# EAGLE schematic vco (EAGLE 8.2.1)
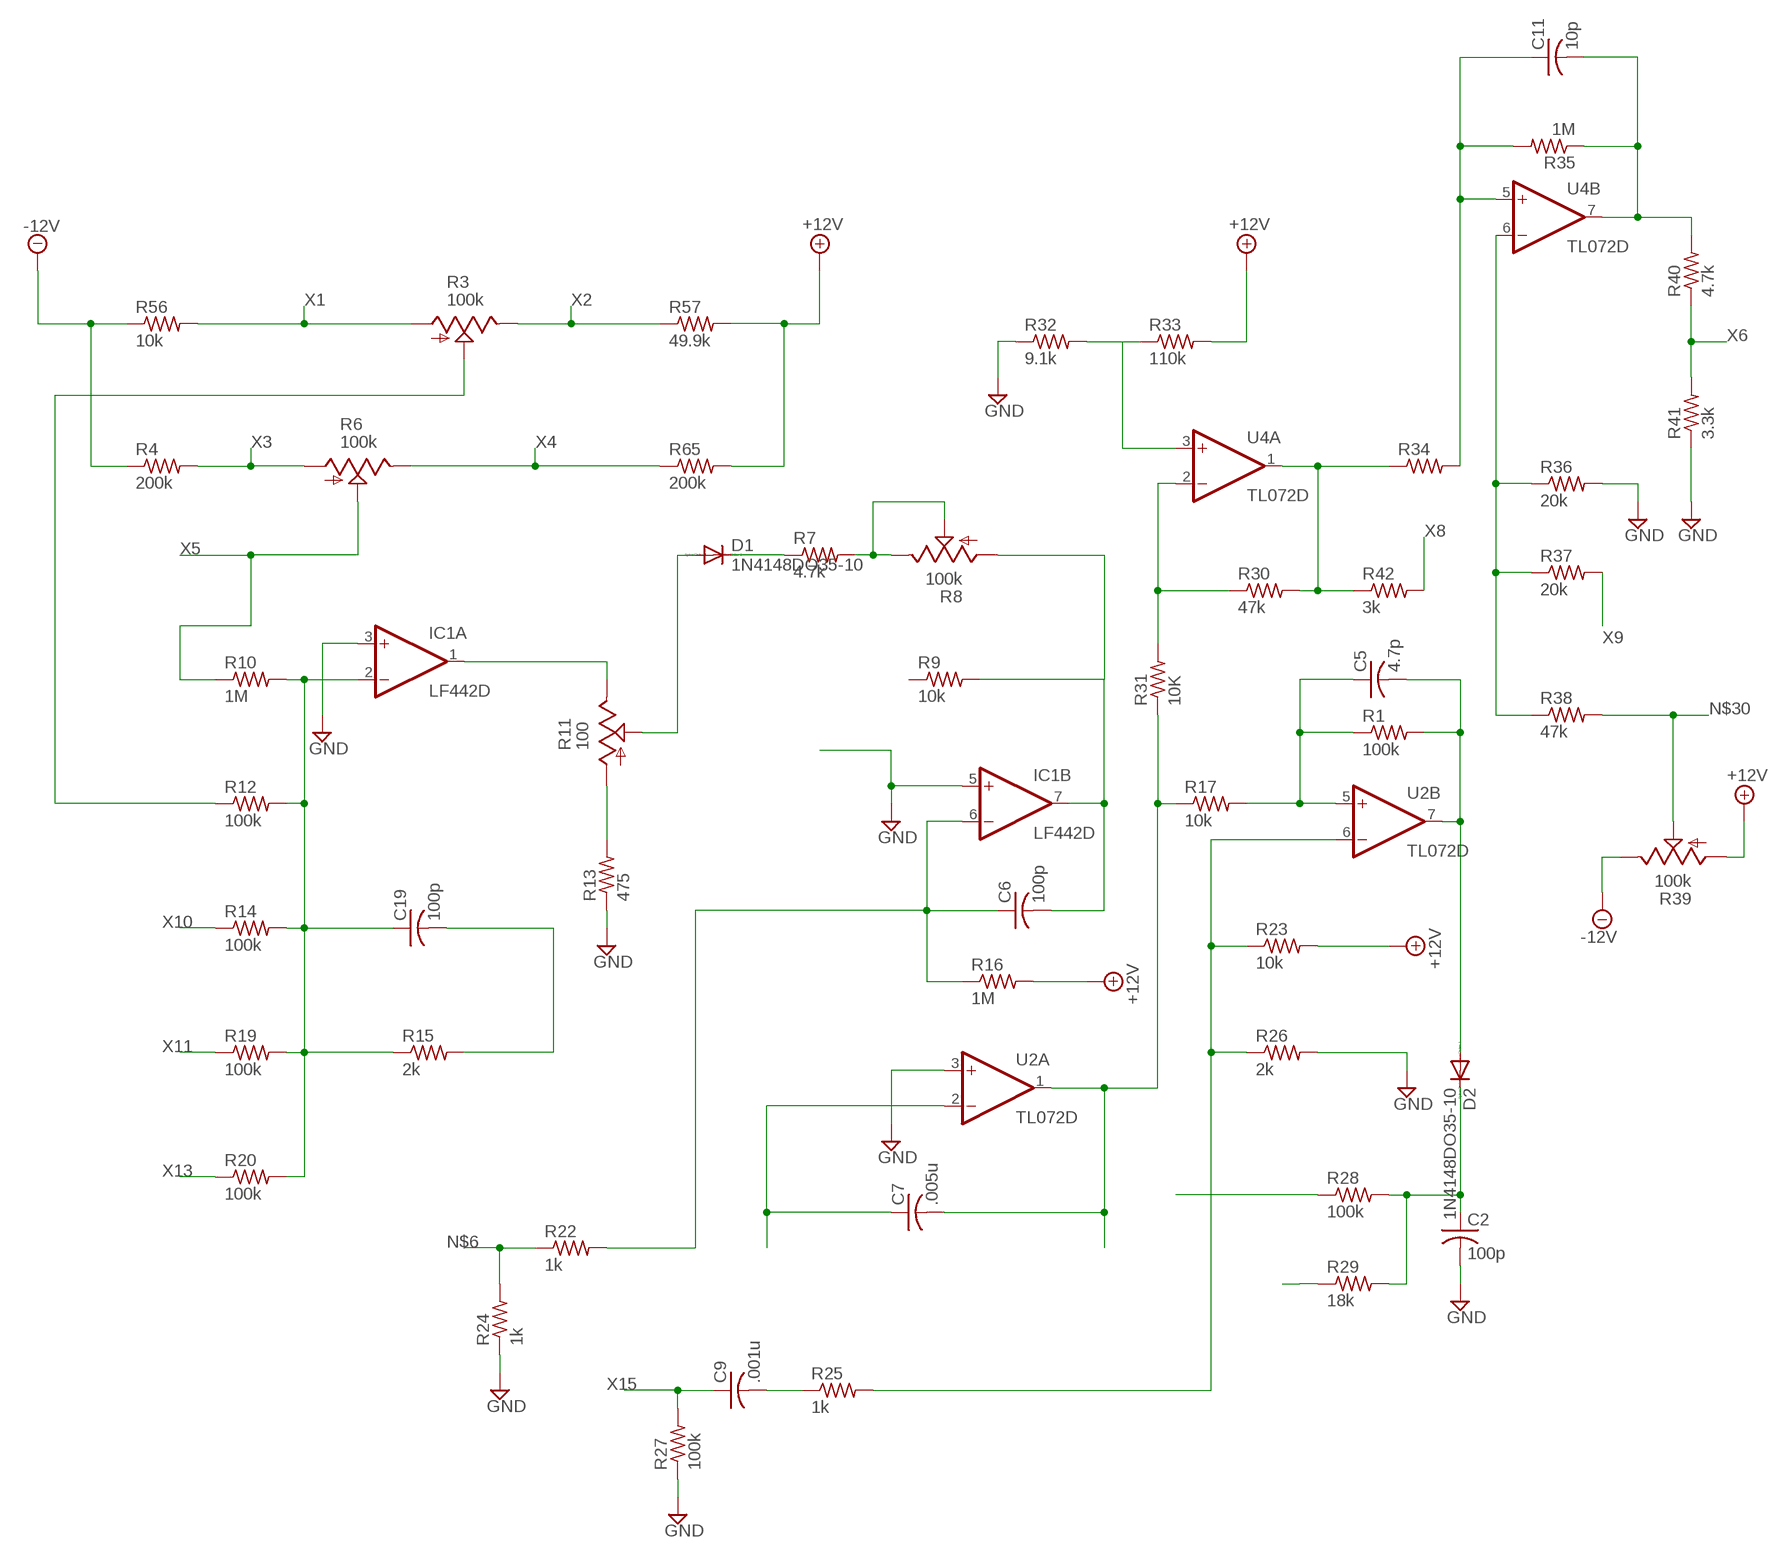
[diagram p0: schematic, sheet 1]

## Parts
C2  100p  C-US050-024X044  [C050-024X044]
C5  4.7p  C-US050-024X044  [C050-024X044]
C6  100p  C-US050-024X044  [C050-024X044]
C7  .005u  C-US050-024X044  [C050-024X044]
C9  .001u  C-US050-024X044  [C050-024X044]
C11  10p  C-US050-024X044  [C050-024X044]
C19  100p  C-US050-024X044  [C050-024X044]
D1  1N4148DO35-10  [DO35-10]
D2  1N4148DO35-10  [DO35-10]
IC1  LF442D  [SO08]
R1  100k  R-US_0309/12  [0309/12]
R3  100k  TRIM_US-PT-10  [PT-10]
R4  200k  R-US_0309/12  [0309/12]
R6  100k  TRIM_US-PT-10  [PT-10]
R7  4.7k  R-US_0309/12  [0309/12]
R8  100k  TRIM_US-PT-10  [PT-10]
R9  10k  R-US_0309/12  [0309/12]
R10  1M  R-US_0309/12  [0309/12]
R11  100  TRIM_US-PT-10  [PT-10]
R12  100k  R-US_0309/12  [0309/12]
R13  475  R-US_0309/12  [0309/12]
R14  100k  R-US_0309/12  [0309/12]
R15  2k  R-US_0309/12  [0309/12]
R16  1M  R-US_0309/12  [0309/12]
R17  10k  R-US_0309/12  [0309/12]
R19  100k  R-US_0309/12  [0309/12]
R20  100k  R-US_0309/12  [0309/12]
R22  1k  R-US_0309/12  [0309/12]
R23  10k  R-US_0309/12  [0309/12]
R24  1k  R-US_0309/12  [0309/12]
R25  1k  R-US_0309/12  [0309/12]
R26  2k  R-US_0309/12  [0309/12]
R27  100k  R-US_0309/12  [0309/12]
R28  100k  R-US_0309/12  [0309/12]
R29  18k  R-US_0309/12  [0309/12]
R30  47k  R-US_0309/12  [0309/12]
R31  10K  R-US_0309/12  [0309/12]
R32  9.1k  R-US_0309/12  [0309/12]
R33  110k  R-US_0309/12  [0309/12]
R34  R-US_0309/12  [0309/12]
R35  1M  R-US_0309/12  [0309/12]
R36  20k  R-US_0309/12  [0309/12]
R37  20k  R-US_0309/12  [0309/12]
R38  47k  R-US_0309/12  [0309/12]
R39  100k  TRIM_US-PT-10  [PT-10]
R40  4.7k  R-US_0309/12  [0309/12]
R41  3.3k  R-US_0309/12  [0309/12]
R42  3k  R-US_0309/12  [0309/12]
R56  10k  R-US_0309/12  [0309/12]
R57  49.9k  R-US_0309/12  [0309/12]
R65  200k  R-US_0309/12  [0309/12]
U2  TL072D  [SO08]
U4  TL072D  [SO08]

## Nets
+12V: R16.2 R23.2 R33.2 R39.A R57.2 R65.2
-12V: R4.1 R39.E R56.1
GND: C2.2 IC1.3(A:+IN) IC1.5(B:+IN) R13.1 R24.1 R26.2 R27.1 R32.1 R36.2 R41.1 U2.3(A:+IN)
N$1: R30.1 R31.2 U4.2(A:-IN)
N$3: R3.S R12.1
N$4: C11.2 R35.1 R40.2 U4.7(B:OUT)
N$6: R22.1 R24.2
N$8: C19.1 IC1.2(A:-IN) R10.2 R12.2 R14.2 R15.1 R19.2 R20.2
N$13: IC1.1(A:OUT) R11.E
N$14: R11.A R13.2
N$15: C19.2 R15.2
N$16: D1.A R11.S
N$19: C6.2 IC1.7(B:OUT) R8.A R9.2
N$20: R7.2 R8.E R8.S
N$21: D1.C R7.1
N$23: R32.2 R33.1 U4.3(A:+IN)
N$24: R30.2 R34.1 R42.1 U4.1(A:OUT)
N$25: C11.1 R34.2 R35.2 U4.5(B:+IN)
N$26: R36.1 R37.1 R38.1 U4.6(B:-IN)
N$28: C5.1 R1.1 R17.2 U2.5(B:+IN)
N$29: C5.2 D2.A R1.2 U2.7(B:OUT)
N$30: R38.2 R39.S
N$31: C2.1 D2.C R28.2 R29.2
N$32: R29.1
N$33: R28.1
N$34: C7.1 U2.2(A:-IN)
N$35: C7.2 R17.1 R31.1 U2.1(A:OUT)
N$36: C9.2 R25.1
N$37: R23.1 R25.2 R26.1 U2.6(B:-IN)
N$40: C6.1 IC1.6(B:-IN) R16.1 R22.2
X1: R3.A R56.2
X2: R3.E R57.1
X3: R4.2 R6.A
X4: R6.E R65.1
X5: R6.S R10.1
X6: R40.1 R41.2
X8: R42.2
X9: R37.2
X10: R14.1
X11: R19.1
X13: R20.1
X15: C9.1 R27.2
Unconnected: R9.1

## Power pins joined to a net without a drawn wire
V+: IC1.8(P:V+) U2.8(P:V+) U4.8(P:V+)
V-: IC1.4(P:V-) U2.4(P:V-) U4.4(P:V-)

## Library data of the parts
C2 C5-C7 C9 C11 C19 = resistor:C-US: CAPACITOR, American symbol
D1 D2 = diode:1N4148: DIODE high speed (Philips)
IC1 = linear:LF442: OP AMP
R1 R4 R7 R9 R10 R12-R17 R19 R20 R22-R38 R40-R42 R56 R57 R65 = resistor:R-US_: RESISTOR, American symbol
R3 R6 R8 R11 R39 = pot:TRIM_US-: POTENTIOMETER
U2 U4 = linear:TL072: OP AMP